# Altium project flatsat_platform_2.PrjPcb (part 3 of 3)
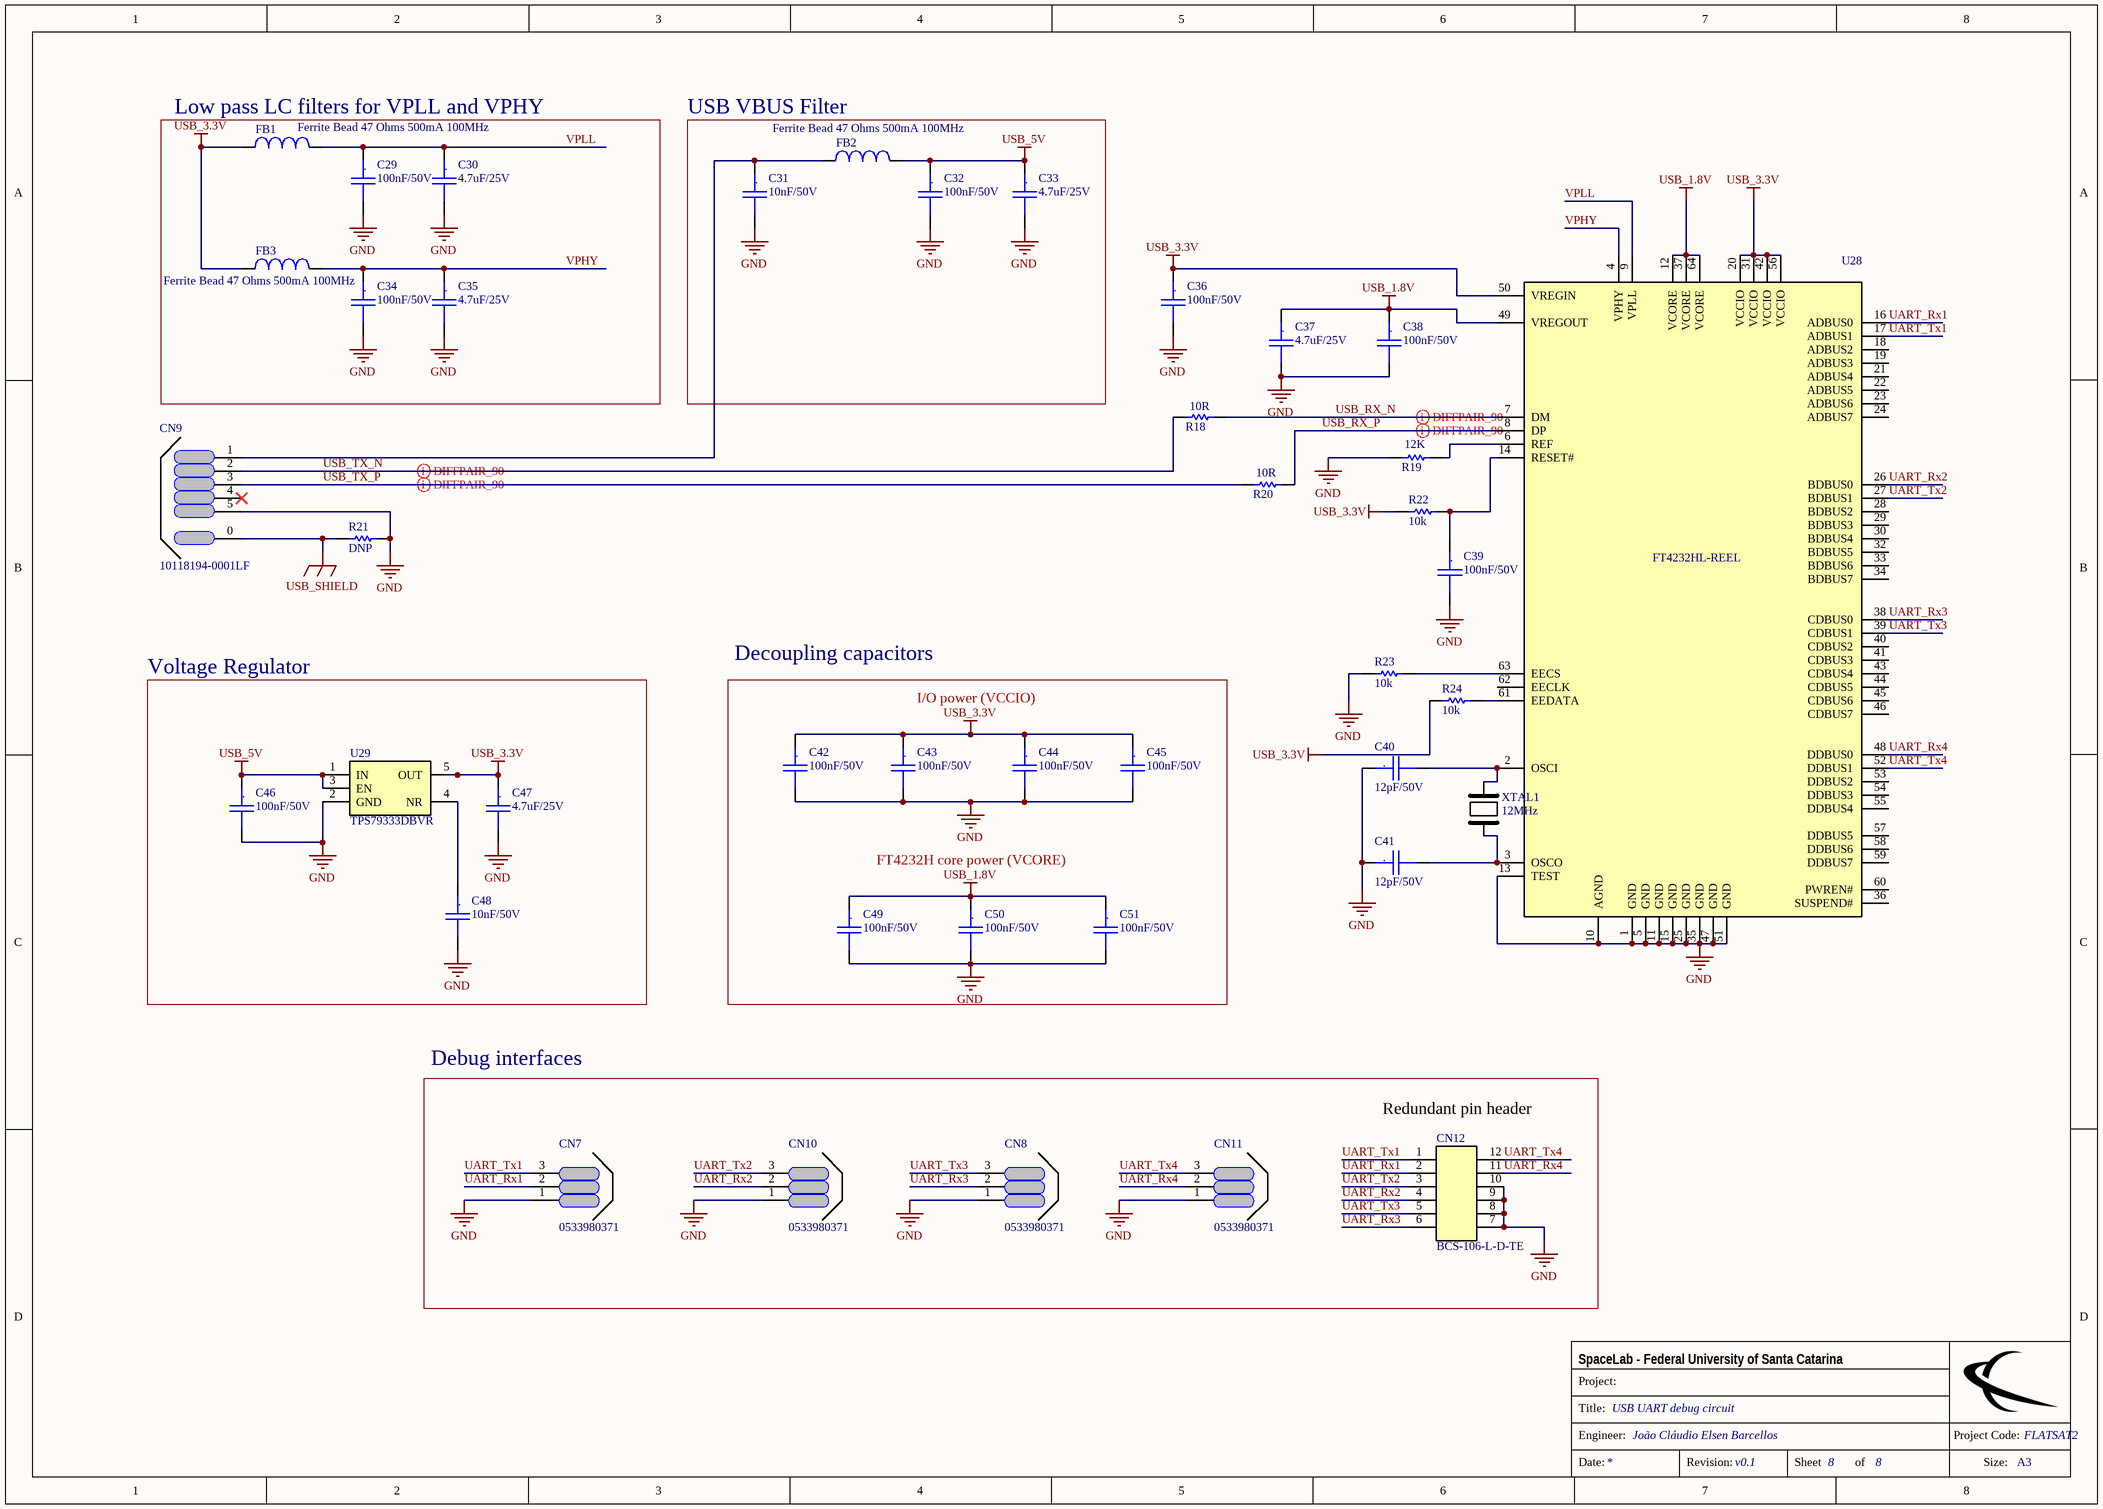
[diagram p10: USB_debug_schematic.SchDoc]

## Nets that join several sheets
GND: microzed_schematic (50 pins), PC104_schematic (9 pins), voltage_level_translators_schematic (71 pins), CAN_schematic (6 pins), power_schematic (52 pins), USB_debug_schematic (46 pins)
USB_1.8V: PC104_schematic (TP7.1), USB_debug_schematic (9 pins)
USB_3.3V: PC104_schematic (TP5.1), USB_debug_schematic (16 pins)
USB_5V: PC104_schematic (TP8.1), USB_debug_schematic (6 pins)
2.5V: PC104_schematic (TP3.1), power_schematic (5 pins)
5V: microzed_schematic (9 pins), PC104_schematic (TP4.1), power_schematic (19 pins)
CAN_CHN_1_N: PC104_schematic (CN23.1), CAN_schematic (5 pins)
CAN_CHN_1_P: PC104_schematic (CN23.3), CAN_schematic (5 pins)
CAN_CHN_2_N: PC104_schematic (CN23.54), CAN_schematic (5 pins)
CAN_CHN_2_P: PC104_schematic (CN23.58), CAN_schematic (5 pins)
CLK_CHN_1: microzed_schematic (SOM1.JX1-35), voltage_level_translators_schematic (U5.3)
CLK_CHN_2: microzed_schematic (SOM1.JX2-19), voltage_level_translators_schematic (U14.5)
CLK_CHN_3: microzed_schematic (SOM1.JX2-54), voltage_level_translators_schematic (U17.1)
CS_CHN_1: microzed_schematic (SOM1.JX1-26), voltage_level_translators_schematic (U8.4)
CS_CHN_2: microzed_schematic (SOM1.JX1-84), voltage_level_translators_schematic (U11.8)
CS_CHN_3: microzed_schematic (SOM1.JX2-55), voltage_level_translators_schematic (U17.5)
EPS_H1-45: PC104_schematic (CN20.45 CN20.46), voltage_level_translators_schematic (R25.1 U1.8)
EPS_H1-47: PC104_schematic (CN20.47 CN20.48), voltage_level_translators_schematic (R27.1 U4.8)
EPS_H1-49: PC104_schematic (CN20.49 CN20.50), voltage_level_translators_schematic (R26.1 U7.8)
EPS_H1-51: PC104_schematic (CN20.51 CN20.52), voltage_level_translators_schematic (R28.1 U9.8)
EPS_H2-25: PC104_schematic (CN20.77 CN20.78), voltage_level_translators_schematic (R30.1 U13.8)
EPS_H2-27: PC104_schematic (CN20.79 CN20.80), voltage_level_translators_schematic (R31.1 U18.8)
EPS_H2-35: PC104_schematic (CN20.87 CN20.88), voltage_level_translators_schematic (R29.1 U12.8)
H1-2: PC104_schematic (6 pins), voltage_level_translators_schematic (U16.14)
H1-4: PC104_schematic (6 pins), voltage_level_translators_schematic (U16.16)
H1-5: PC104_schematic (6 pins), voltage_level_translators_schematic (U16.20)
H1-6: PC104_schematic (6 pins), voltage_level_translators_schematic (U15.12)
H1-7: PC104_schematic (6 pins), voltage_level_translators_schematic (U15.14)
H1-8: PC104_schematic (6 pins), voltage_level_translators_schematic (U15.15)
H1-9: PC104_schematic (6 pins), voltage_level_translators_schematic (U15.18)
H1-10: PC104_schematic (6 pins), voltage_level_translators_schematic (U15.20)
H1-11: PC104_schematic (6 pins), voltage_level_translators_schematic (U14.14)
H1-12: PC104_schematic (6 pins), voltage_level_translators_schematic (U14.15)
H1-13: PC104_schematic (6 pins), voltage_level_translators_schematic (U14.18)
H1-14: PC104_schematic (6 pins), voltage_level_translators_schematic (U14.20)
H1-15: PC104_schematic (6 pins), voltage_level_translators_schematic (U11.14)
H1-16: PC104_schematic (6 pins), voltage_level_translators_schematic (U11.15)
H1-17: PC104_schematic (6 pins), voltage_level_translators_schematic (U11.18)
H1-18: PC104_schematic (6 pins), voltage_level_translators_schematic (U11.20)
H1-19: PC104_schematic (6 pins), voltage_level_translators_schematic (U10.14)
H1-20: PC104_schematic (6 pins), voltage_level_translators_schematic (U10.15)
H1-21: PC104_schematic (6 pins), voltage_level_translators_schematic (U10.18)
H1-22: PC104_schematic (6 pins), voltage_level_translators_schematic (U10.20)
H1-23: PC104_schematic (6 pins), voltage_level_translators_schematic (U6.14)
H1-24: PC104_schematic (6 pins), voltage_level_translators_schematic (U6.15)
H1-25: PC104_schematic (6 pins), voltage_level_translators_schematic (U6.18)
H1-26: PC104_schematic (6 pins), voltage_level_translators_schematic (U6.20)
H1-27: PC104_schematic (6 pins), voltage_level_translators_schematic (U5.12)
H1-28: PC104_schematic (6 pins), voltage_level_translators_schematic (U5.13)
H1-33: PC104_schematic (6 pins), voltage_level_translators_schematic (U5.14)
H1-34: PC104_schematic (6 pins), voltage_level_translators_schematic (U5.15)
H1-35: PC104_schematic (6 pins), voltage_level_translators_schematic (U5.18)
H1-36: PC104_schematic (6 pins), voltage_level_translators_schematic (U5.20)
H1-37: PC104_schematic (6 pins), voltage_level_translators_schematic (U8.12)
H1-38: PC104_schematic (6 pins), voltage_level_translators_schematic (U8.13)
H1-39: PC104_schematic (6 pins), voltage_level_translators_schematic (U8.16)
H1-40: PC104_schematic (6 pins), voltage_level_translators_schematic (U8.17)
H1-41: PC104_schematic (6 pins), voltage_level_translators_schematic (U2.20 U20.20)
H1-42: PC104_schematic (6 pins), voltage_level_translators_schematic (U3.12)
H1-43: PC104_schematic (6 pins), voltage_level_translators_schematic (U2.18 U20.18)
H1-44: PC104_schematic (6 pins), voltage_level_translators_schematic (U3.14)
H1-45: PC104_schematic (10 pins), voltage_level_translators_schematic (R25.2 U1.7)
H1-47: PC104_schematic (10 pins), voltage_level_translators_schematic (R27.2 U4.7)
H1-49: PC104_schematic (10 pins), voltage_level_translators_schematic (R26.2 U7.7)
H1-51: PC104_schematic (10 pins), voltage_level_translators_schematic (R28.2 U9.7)
H1_N: PC104_schematic (5 pins), CAN_schematic (S3.2A)
H1_P: PC104_schematic (5 pins), CAN_schematic (S3.1A)
H2-1: PC104_schematic (6 pins), voltage_level_translators_schematic (U16.15)
H2-3: PC104_schematic (6 pins), voltage_level_translators_schematic (U16.18)
H2-4: PC104_schematic (6 pins), voltage_level_translators_schematic (U16.17)
H2-5: PC104_schematic (6 pins), voltage_level_translators_schematic (U15.13)
H2-7: PC104_schematic (6 pins), voltage_level_translators_schematic (U15.17)
H2-8: PC104_schematic (6 pins), voltage_level_translators_schematic (U15.16)
H2-9: PC104_schematic (6 pins), voltage_level_translators_schematic (U14.13)
H2-10: PC104_schematic (6 pins), voltage_level_translators_schematic (U14.12)
H2-11: PC104_schematic (6 pins), voltage_level_translators_schematic (U14.17)
H2-12: PC104_schematic (6 pins), voltage_level_translators_schematic (U14.16)
H2-13: PC104_schematic (6 pins), voltage_level_translators_schematic (U11.13)
H2-14: PC104_schematic (6 pins), voltage_level_translators_schematic (U11.12)
H2-15: PC104_schematic (6 pins), voltage_level_translators_schematic (U11.17)
H2-16: PC104_schematic (6 pins), voltage_level_translators_schematic (U11.16)
H2-17: PC104_schematic (6 pins), voltage_level_translators_schematic (U10.13)
H2-18: PC104_schematic (6 pins), voltage_level_translators_schematic (U10.12)
H2-19: PC104_schematic (6 pins), voltage_level_translators_schematic (U10.17)
H2-20: PC104_schematic (6 pins), voltage_level_translators_schematic (U10.16)
H2-21: PC104_schematic (6 pins), voltage_level_translators_schematic (U6.13)
H2-22: PC104_schematic (6 pins), voltage_level_translators_schematic (U6.12)
H2-23: PC104_schematic (6 pins), voltage_level_translators_schematic (U6.17)
H2-24: PC104_schematic (6 pins), voltage_level_translators_schematic (U6.16)
H2-25: PC104_schematic (10 pins), voltage_level_translators_schematic (R30.2 U13.7)
H2-27: PC104_schematic (10 pins), voltage_level_translators_schematic (R31.2 U18.7)
H2-33: PC104_schematic (6 pins), voltage_level_translators_schematic (U5.17)
H2-34: PC104_schematic (6 pins), voltage_level_translators_schematic (U5.16)
H2-35: PC104_schematic (10 pins), voltage_level_translators_schematic (R29.2 U12.7)
H2-37: PC104_schematic (6 pins), voltage_level_translators_schematic (U8.15)
H2-38: PC104_schematic (6 pins), voltage_level_translators_schematic (U8.14)
H2-39: PC104_schematic (6 pins), voltage_level_translators_schematic (U8.20)
H2-40: PC104_schematic (6 pins), voltage_level_translators_schematic (U8.18)
H2-42: PC104_schematic (6 pins), voltage_level_translators_schematic (U3.13)
H2-44: PC104_schematic (6 pins), voltage_level_translators_schematic (U3.15)
H2-47: PC104_schematic (6 pins), voltage_level_translators_schematic (U3.17)
H2-48: PC104_schematic (6 pins), voltage_level_translators_schematic (U3.16)
H2-49: PC104_schematic (6 pins), voltage_level_translators_schematic (U2.17 U20.17)
H2-50: PC104_schematic (6 pins), voltage_level_translators_schematic (U3.18)
H2-51: PC104_schematic (6 pins), voltage_level_translators_schematic (U2.16 U20.16)
H2-52: PC104_schematic (6 pins), voltage_level_translators_schematic (U3.20)
H2_N: PC104_schematic (5 pins), CAN_schematic (S6.2A)
H2_P: PC104_schematic (5 pins), CAN_schematic (S6.1A)
MISO_CHN_1: microzed_schematic (SOM1.JX1-31), voltage_level_translators_schematic (U8.9)
MISO_CHN_2: microzed_schematic (SOM1.JX1-83), voltage_level_translators_schematic (U11.9)
MISO_CHN_3: microzed_schematic (SOM1.JX2-53), voltage_level_translators_schematic (U17.3)
MOSI_CHN_1: microzed_schematic (SOM1.JX1-25), voltage_level_translators_schematic (U8.5)
MOSI_CHN_2: microzed_schematic (SOM1.JX2-20), voltage_level_translators_schematic (U14.4)
MOSI_CHN_3: microzed_schematic (SOM1.JX2-56), voltage_level_translators_schematic (U17.4)
P1: microzed_schematic (SOM1.JX1-12), voltage_level_translators_schematic (U3.1)
P2: microzed_schematic (SOM1.JX1-11), voltage_level_translators_schematic (U3.3)
P3: microzed_schematic (SOM1.JX1-14), voltage_level_translators_schematic (U3.4)
P4: microzed_schematic (SOM1.JX1-13), voltage_level_translators_schematic (U3.5)
P5: microzed_schematic (SOM1.JX1-18), voltage_level_translators_schematic (U3.6)
P6: microzed_schematic (SOM1.JX1-17), voltage_level_translators_schematic (U3.7)
P7: microzed_schematic (SOM1.JX1-20), voltage_level_translators_schematic (U3.8)
P8: microzed_schematic (SOM1.JX1-19), voltage_level_translators_schematic (U3.9)
P9: microzed_schematic (SOM1.JX1-24), voltage_level_translators_schematic (U8.1)
P10: microzed_schematic (SOM1.JX1-23), voltage_level_translators_schematic (U8.3)
P11: microzed_schematic (SOM1.JX1-30), voltage_level_translators_schematic (U8.6)
P12: microzed_schematic (SOM1.JX1-29), voltage_level_translators_schematic (U8.7)
P13: microzed_schematic (SOM1.JX1-32), voltage_level_translators_schematic (U8.8)
P14: microzed_schematic (SOM1.JX1-36), voltage_level_translators_schematic (U5.1)
P15: microzed_schematic (SOM1.JX1-38), voltage_level_translators_schematic (U5.4)
P16: microzed_schematic (SOM1.JX1-37), voltage_level_translators_schematic (U5.5)
P17: microzed_schematic (SOM1.JX1-42), voltage_level_translators_schematic (U5.6)
P18: microzed_schematic (SOM1.JX1-41), voltage_level_translators_schematic (U5.7)
P19: microzed_schematic (SOM1.JX1-44), voltage_level_translators_schematic (U5.8)
P20: microzed_schematic (SOM1.JX1-43), voltage_level_translators_schematic (U5.9)
P21: microzed_schematic (SOM1.JX1-48), voltage_level_translators_schematic (U6.1)
P22: microzed_schematic (SOM1.JX1-47), voltage_level_translators_schematic (U6.3)
P23: microzed_schematic (SOM1.JX1-50), voltage_level_translators_schematic (U6.4)
P24: microzed_schematic (SOM1.JX1-49), voltage_level_translators_schematic (U6.5)
P25: microzed_schematic (SOM1.JX1-54), voltage_level_translators_schematic (U6.6)
P26: microzed_schematic (SOM1.JX1-53), voltage_level_translators_schematic (U6.7)
P27: microzed_schematic (SOM1.JX1-56), voltage_level_translators_schematic (U6.8)
P28: microzed_schematic (SOM1.JX1-55), voltage_level_translators_schematic (U6.9)
P29: microzed_schematic (SOM1.JX1-62), voltage_level_translators_schematic (U10.1)
P30: microzed_schematic (SOM1.JX1-61), voltage_level_translators_schematic (U10.3)
P31: microzed_schematic (SOM1.JX1-64), voltage_level_translators_schematic (U10.4)
P32: microzed_schematic (SOM1.JX1-63), voltage_level_translators_schematic (U10.5)
P33: microzed_schematic (SOM1.JX1-68), voltage_level_translators_schematic (U10.6)
P34: microzed_schematic (SOM1.JX1-70), voltage_level_translators_schematic (U10.8)
P35: microzed_schematic (SOM1.JX1-69), voltage_level_translators_schematic (U10.9)
P36: microzed_schematic (SOM1.JX1-74), voltage_level_translators_schematic (U11.1)
P37: microzed_schematic (SOM1.JX1-76), voltage_level_translators_schematic (U11.4)
P38: microzed_schematic (SOM1.JX1-75), voltage_level_translators_schematic (U11.5)
P39: microzed_schematic (SOM1.JX1-82), voltage_level_translators_schematic (U11.6)
P40: microzed_schematic (SOM1.JX1-81), voltage_level_translators_schematic (U11.7)
P41: microzed_schematic (SOM1.JX2-18), voltage_level_translators_schematic (U14.1)
P42: microzed_schematic (SOM1.JX2-17), voltage_level_translators_schematic (U14.3)
P43: microzed_schematic (SOM1.JX2-24), voltage_level_translators_schematic (U14.6)
P44: microzed_schematic (SOM1.JX2-23), voltage_level_translators_schematic (U14.7)
P45: microzed_schematic (SOM1.JX2-26), voltage_level_translators_schematic (U14.8)
P46: microzed_schematic (SOM1.JX2-25), voltage_level_translators_schematic (U14.9)
P47: microzed_schematic (SOM1.JX2-30), voltage_level_translators_schematic (U15.1)
P48: microzed_schematic (SOM1.JX2-29), voltage_level_translators_schematic (U15.3)
P49: microzed_schematic (SOM1.JX2-31), voltage_level_translators_schematic (U15.5)
P50: microzed_schematic (SOM1.JX2-36), voltage_level_translators_schematic (U15.6)
P51: microzed_schematic (SOM1.JX2-35), voltage_level_translators_schematic (U15.7)
P52: microzed_schematic (SOM1.JX2-37), voltage_level_translators_schematic (U15.9)
P53: microzed_schematic (SOM1.JX2-42), voltage_level_translators_schematic (U16.1)
P54: microzed_schematic (SOM1.JX2-41), voltage_level_translators_schematic (U16.3)
P55: microzed_schematic (SOM1.JX2-44), voltage_level_translators_schematic (U16.4)
P56: microzed_schematic (SOM1.JX2-43), voltage_level_translators_schematic (U16.5)
P57: microzed_schematic (SOM1.JX2-48), voltage_level_translators_schematic (U16.6)
P58: microzed_schematic (SOM1.JX2-47), voltage_level_translators_schematic (U16.7)
P59: microzed_schematic (SOM1.JX2-63), voltage_level_translators_schematic (U20.1)
P60: microzed_schematic (SOM1.JX2-68), voltage_level_translators_schematic (U20.3)
P61: microzed_schematic (SOM1.JX2-67), voltage_level_translators_schematic (U20.4)
P62: microzed_schematic (SOM1.JX2-70), voltage_level_translators_schematic (U20.5)
PWR_EN: microzed_schematic (SOM1.JX1-5), PC104_schematic (TP1.1), power_schematic (D2.3 R3.2)
REG_EN: PC104_schematic (TP16.1), power_schematic (5 pins)
RX_CHN_1: microzed_schematic (SOM1.JX1-73), voltage_level_translators_schematic (U11.3)
RX_CHN_2: microzed_schematic (SOM1.JX2-38), voltage_level_translators_schematic (U15.8)
RX_CHN_3: microzed_schematic (SOM1.JX2-62), voltage_level_translators_schematic (U22.1)
RXD_CHN_1: microzed_schematic (SOM1.JX2-4), CAN_schematic (U23.4)
RXD_CHN_2: microzed_schematic (SOM1.JX2-3), CAN_schematic (U24.4)
SCL_CHN_1: microzed_schematic (SOM1.JX2-7), voltage_level_translators_schematic (U2.3)
SCL_CHN_2: microzed_schematic (SOM1.JX2-8), voltage_level_translators_schematic (U2.5)
SCL_CHN_3: microzed_schematic (SOM1.JX2-49), voltage_level_translators_schematic (U2.7)
SDA_CHN_1: microzed_schematic (SOM1.JX2-5), voltage_level_translators_schematic (U2.1)
SDA_CHN_2: microzed_schematic (SOM1.JX2-6), voltage_level_translators_schematic (U2.4)
SDA_CHN_3: microzed_schematic (SOM1.JX2-50), voltage_level_translators_schematic (U2.6)
T/R: microzed_schematic (SOM1.JX2-64), voltage_level_translators_schematic (U22.2 U22.4)
TX_CHN_1: microzed_schematic (SOM1.JX1-67), voltage_level_translators_schematic (U10.7)
TX_CHN_2: microzed_schematic (SOM1.JX2-32), voltage_level_translators_schematic (U15.4)
TX_CHN_3: microzed_schematic (SOM1.JX2-61), voltage_level_translators_schematic (U22.3)
TXD_CHN_1: microzed_schematic (SOM1.JX2-2), CAN_schematic (U23.1)
TXD_CHN_2: microzed_schematic (SOM1.JX2-1), CAN_schematic (U24.1)
V1_E: PC104_schematic (TP12.1), power_schematic (8 pins)
V2_E: PC104_schematic (TP13.1), power_schematic (8 pins)
VBAT: microzed_schematic (SOM1.JX1-7), PC104_schematic (TP14.1), power_schematic (C12.1 C13.1 CN16.1)
VCCA: PC104_schematic (TP9.1), voltage_level_translators_schematic (24 pins), power_schematic (CN17.1)
VCCB: PC104_schematic (TP10.1), voltage_level_translators_schematic (12 pins), power_schematic (CN18.1)
VCCIO: microzed_schematic (7 pins), PC104_schematic (TP6.1), power_schematic (7 pins)
VCCIO_EN: microzed_schematic (SOM1.JX2-10), PC104_schematic (TP2.1), power_schematic (D3.3 R8.2 R11.2)
VCHARG: PC104_schematic (TP15.1), power_schematic (CN3.3 CN3.4 CN15.1)
VS: PC104_schematic (TP11.1), voltage_level_translators_schematic (20 pins), CAN_schematic (U23.3 U24.3), power_schematic (CN19.1)